# Altium schematic sheet Si7021.SchDoc
size A
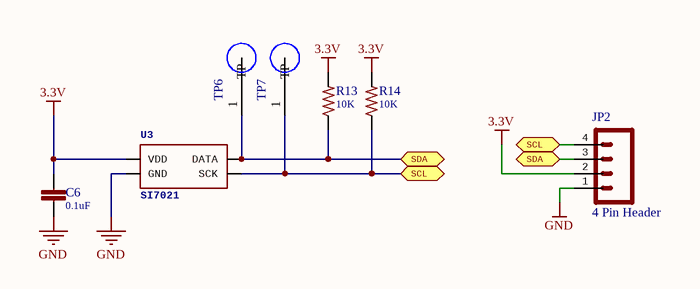
[diagram p0: Si7021.SchDoc]

## Parts
C6  value 0.1uF  (hidden comment: Cap0.1uF)
JP2  4 Pin Header
R13  value 10K  (hidden comment: Res10K)
R14  value 10K  (hidden comment: Res10K)
TP6  5019  [*TP380X203]  (value not drawn)
TP7  5019  [*TP380X203]  (value not drawn)
U3  SI7021  [SI7021]

## Ports
SCL, SDA

## Nets
3.3V: C6.1 JP2.2 R13.2 R14.2 U3.VDD
GND: C6.2 JP2.1 U3.GND
SCL: JP2.4 R14.1 TP7.1(TP) U3.SCK ; port SCL
SDA: JP2.3 R13.1 TP6.1(TP) U3.DATA ; port SDA

## Library data of the parts
TP6 TP7 = 5019: Phosphor Bronze Contact Miniature Silver Plated Surface Mount Test Points; MF: Keystone Electronics; Package: 2010 Keystone; Price: None; Availability: Unavailable; MP: 5019; SnapEDA_Link: https://www.snapeda.com/parts/5019/Keystone%20Electronics/view-part/?ref=snap; Value: *
U3 = SI7021: The Si7021 is an I2C Humidity and Temperature Sensor; PROD_ID: IC-13093